# Altium schematic sheet JTAG.SchDoc
size A
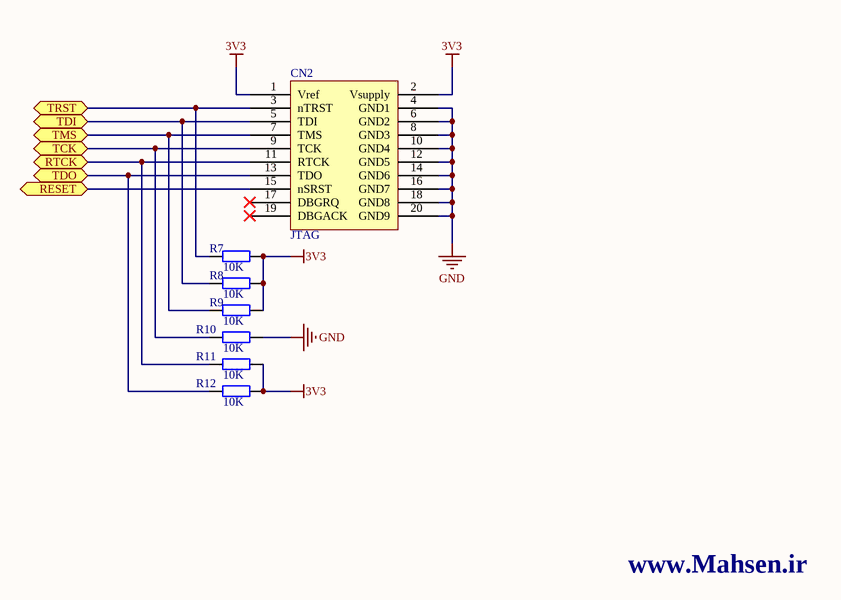
[diagram p0: JTAG.SchDoc]

## Parts
CN2  JTAG  [FKV20SN]
R7  10K  [0805]
R8  10K  [0805]
R9  10K  [0805]
R10  10K  [0805]
R11  10K  [0805]
R12  10K  [0805]

## Ports
RESET (bidir), RTCK (bidir), TCK (bidir), TDI (bidir), TDO (bidir), TMS (bidir), TRST (bidir)

## Nets
3V3: CN2.1(Vref) CN2.2(Vsupply) R7.1 R8.1 R9.1 R11.1 R12.1
GND: CN2.4(GND1) CN2.6(GND2) CN2.8(GND3) CN2.10(GND4) CN2.12(GND5) CN2.14(GND6) CN2.16(GND7) CN2.18(GND8) CN2.20(GND9) R10.1
RESET: CN2.15(nSRST) ; port RESET
RTCK: CN2.11(RTCK) R11.2 ; port RTCK
TCK: CN2.9(TCK) R10.2 ; port TCK
TDI: CN2.5(TDI) R8.2 ; port TDI
TDO: CN2.13(TDO) R12.2 ; port TDO
TMS: CN2.7(TMS) R9.2 ; port TMS
TRST: CN2.3(nTRST) R7.2 ; port TRST

Not connected (* = marked no-connect by the designer): CN2 17(DBGRQ)* 19(DBGACK)*

## Notes on the sheet
- www.Mahsen.ir

## Library data of the parts
R7-R12 = Res2: Resistor; Published: 8-Jun-2000; LatestRevisionDate: 17-Jul-2002; LatestRevisionNote: Re-released for DXP Platform.; PackageReference: AXIAL-0.4; Publisher: Altium Limited; PackageDescription: Axial Device, Thru-Hole; 2 Leads; 0.4 in Pin Spacing; Value: 10K